# EAGLE schematic ambilight (EAGLE 6.4)
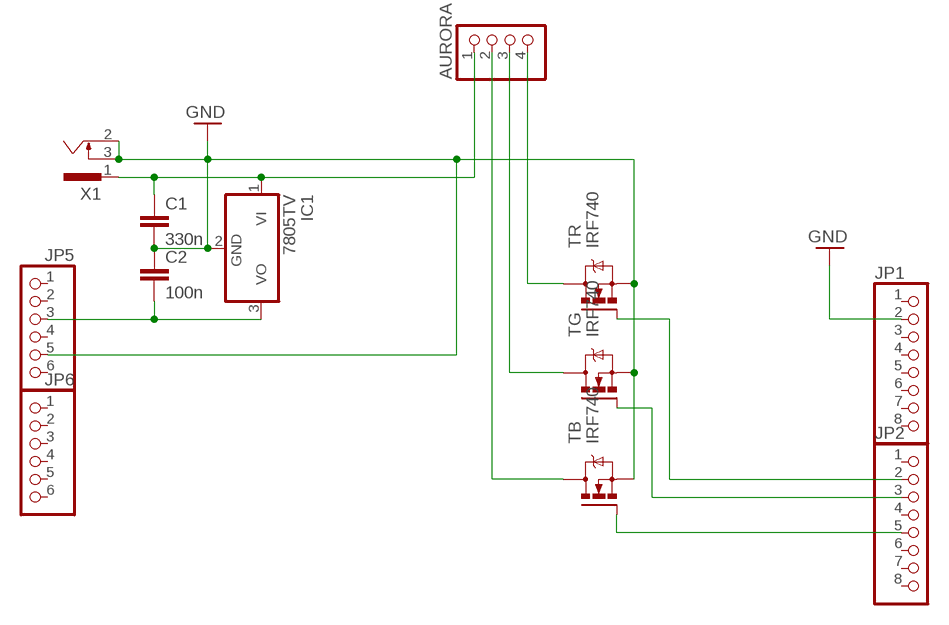
[diagram p0: schematic, sheet 1]

## Parts
AURORA  PINHD-1X4  [1X04]
C1  330n  C-EU025-050X050  [C025-050X050]
C2  100n  C-EU025-050X050  [C025-050X050]
IC1  7805TV  [TO220V]
JP1  PINHD-1X8  [1X08]
JP2  PINHD-1X8  [1X08]
JP5  PINHD-1X6  [1X06]
JP6  PINHD-1X6  [1X06]
TB  IRF740  [TO220BV]
TG  IRF740  [TO220BV]
TR  IRF740  [TO220BV]
X1  733980-62  [733980-62]

## Nets
GND: C1.2 C2.1 IC1.2(GND) JP1.2 JP5.5 TB.S TG.S TR.S X1.2 X1.3
N$4: C2.2 IC1.3(VO) JP5.3
N$6: AURORA.1 C1.1 IC1.1(VI) X1.1
N$7: JP2.5 TB.G
N$9: JP2.3 TG.G
N$10: JP2.2 TR.G
N$11: AURORA.4 TR.D
N$12: AURORA.3 TG.D
N$13: AURORA.2 TB.D
Unconnected: JP1.1 JP1.3 JP1.4 JP1.5 JP1.6 JP1.7 JP1.8 JP2.1 JP2.4 JP2.6 JP2.7 JP2.8 JP5.1 JP5.2 JP5.4 JP5.6 JP6.1 JP6.2 JP6.3 JP6.4 JP6.5 JP6.6

## Library data of the parts
AURORA = pinhead:PINHD-1X4: PIN HEADER
C1 C2 = rcl:C-EU: CAPACITOR, European symbol
IC1 = linear:78*: Positive VOLTAGE REGULATOR Source: http://cache.national.com/ds/LM/LM78L05.pdf http://www.fairchildsemi.com/ds/LM/LM7805.pdf
JP1 JP2 = pinhead:PINHD-1X8: PIN HEADER
JP5 JP6 = pinhead:PINHD-1X6: PIN HEADER
TB TG TR = transistor-power:IRF740: N-CHANNEL MOS FET
X1 = con-conrad:73398?: FEMALE PRINT CONNECTOR Niedervolt-Steckverbinder Distributor Conrad